# Altium project STM32H743VIT6 Test B'd.PrjPcb
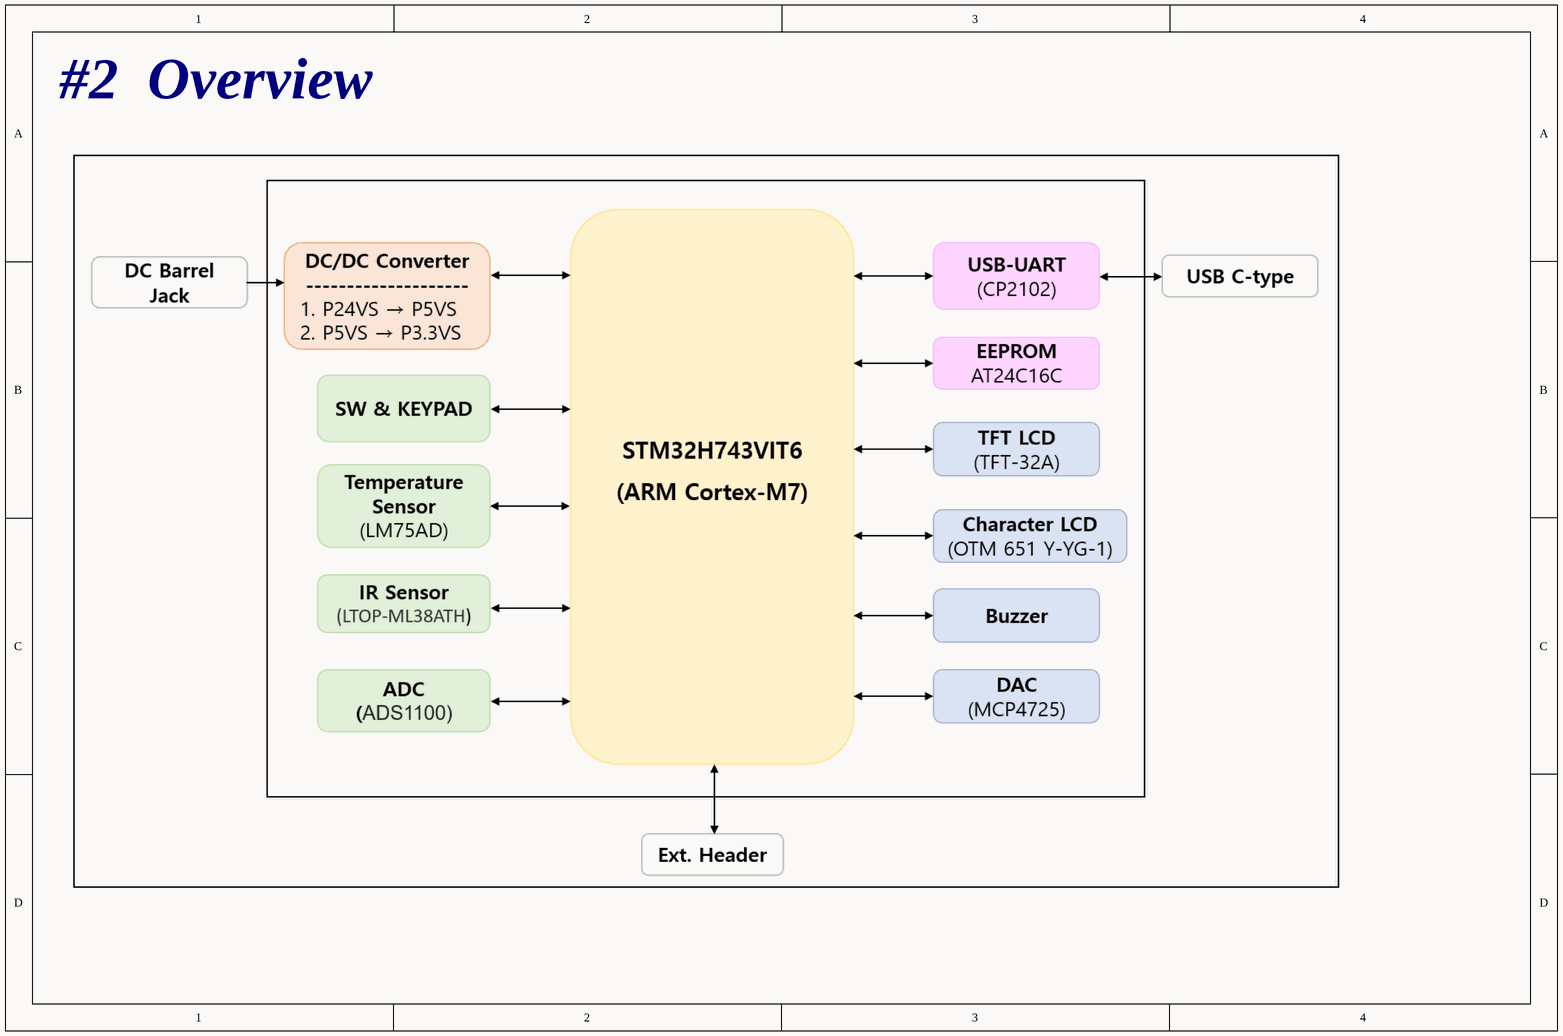
[diagram p0: 01_Overview.SchDoc]
5 sheets, 116 parts. Net scope: flat (ports and power ports of the same name join across sheets).
Board file: STM32H743VIT6_Test_B'd.PcbDoc
Sheets:
  01_Overview.SchDoc
  03_MCU.SchDoc
  04_LCD.SchDoc
  05_Sensor_Keypad.SchDoc
  06_Communication.SchDoc

## Sheet 01_Overview.SchDoc
size A4; Revision: B; SheetNumber: 2; SheetTotal: 7

### Notes on the sheet
- #2  Overview
- Title
- Rev
- Doc
- Sheet #
- of
- Author
- This document is copyright of ArkX and shall not be revealed, produced, copied, in whole or in part,
- Date
- ©2024
- nor used for any purpose other than submitted.

## Sheet 03_MCU.SchDoc
size A3; Author: Ganghyeok Lim; Revision: B; SheetNumber: 4; SheetTotal: 7
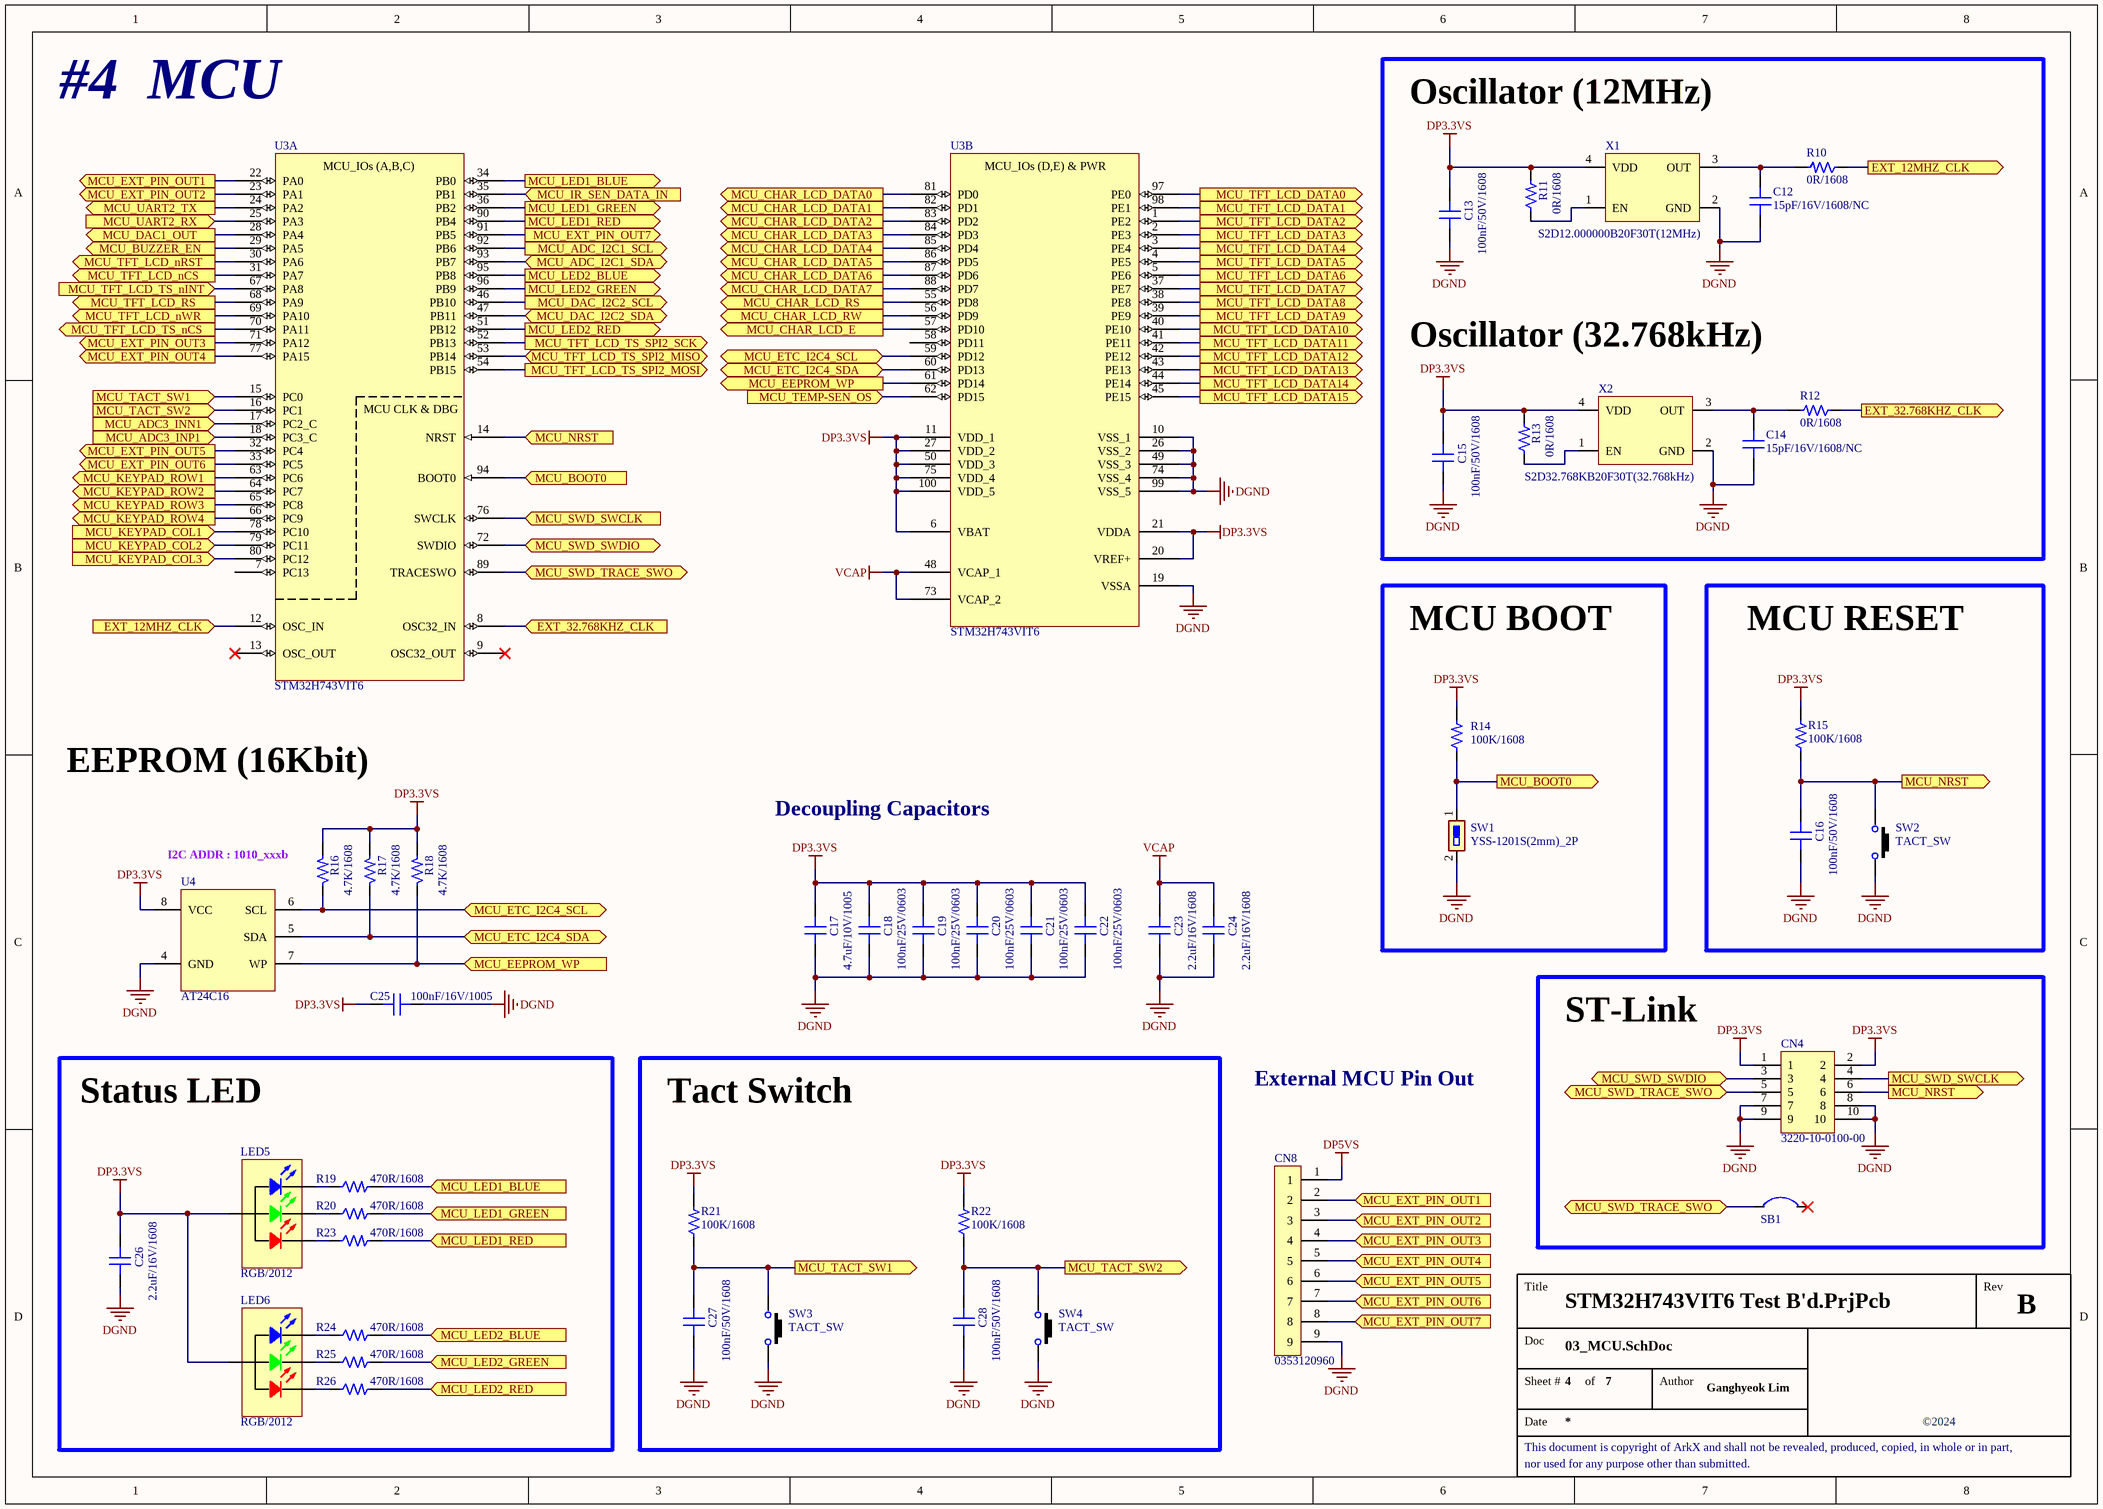
[diagram p1: 03_MCU.SchDoc]

### Parts
C12  15pF/16V/1608/NC  [CAP 1608 (0603_INCH)/NC]
C13  100nF/50V/1608  [CAP 1608 (0603_INCH)]
C14  15pF/16V/1608/NC  [CAP 1608 (0603_INCH)/NC]
C15  100nF/50V/1608  [CAP 1608 (0603_INCH)]
C16  100nF/50V/1608  [CAP 1608 (0603_INCH)]
C17  4.7uF/10V/1005  [CAP 1005 (0402_INCH)]
C18  100nF/25V/0603  [CAP 0603 (0201_INCH)]
C19  100nF/25V/0603  [CAP 0603 (0201_INCH)]
C20  100nF/25V/0603  [CAP 0603 (0201_INCH)]
C21  100nF/25V/0603  [CAP 0603 (0201_INCH)]
C22  100nF/25V/0603  [CAP 0603 (0201_INCH)]
C23  2.2uF/16V/1608  [CAP 1608 (0603_INCH)]
C24  2.2uF/16V/1608  [CAP 1608 (0603_INCH)]
C25  100nF/16V/1005  [CAP 1005 (0402_INCH)]
C26  2.2uF/16V/1608  [CAP 1608 (0603_INCH)]
C27  100nF/50V/1608  [CAP 1608 (0603_INCH)]
C28  100nF/50V/1608  [CAP 1608 (0603_INCH)]
CN4  3220-10-0100-00  [CON 3220-10-0100-00 (Hand_Solder)]
CN8  0353120960  [CON 0353120960 (MOLEX)]
LED5  RGB/2012  [LED MHT170RGBCT]
LED6  RGB/2012  [LED MHT170RGBCT]
R10  0R/1608  [RES 1608 (0603_inch)]
R11  0R/1608  [RES 1608 (0603_inch)]
R12  0R/1608  [RES 1608 (0603_inch)]
R13  0R/1608  [RES 1608 (0603_inch)]
R14  100K/1608  [RES 1608 (0603_inch)]
R15  100K/1608  [RES 1608 (0603_inch)]
R16  4.7K/1608  [RES 1608 (0603_inch)]
R17  4.7K/1608  [RES 1608 (0603_inch)]
R18  4.7K/1608  [RES 1608 (0603_inch)]
R19  470R/1608  [RES 1608 (0603_inch)]
R20  470R/1608  [RES 1608 (0603_inch)]
R21  100K/1608  [RES 1608 (0603_inch)]
R22  100K/1608  [RES 1608 (0603_inch)]
R23  470R/1608  [RES 1608 (0603_inch)]
R24  470R/1608  [RES 1608 (0603_inch)]
R25  470R/1608  [RES 1608 (0603_inch)]
R26  470R/1608  [RES 1608 (0603_inch)]
SB1  SB  [SB (Solder-Bridge)]  (value not drawn)
SW1  YSS-1201S(2mm)_2P  [SW YSS-1201S-2mm]
SW2  TACT_SW  [SW K2-1102SP-C4SC-04]
SW3  TACT_SW  [SW K2-1102SP-C4SC-04]
SW4  TACT_SW  [SW K2-1102SP-C4SC-04]
U3  STM32H743VIT6  [LQFP-100_14x14MM (ST)]  (parts A,B of 2)
U4  AT24C16  [TSSOP-8_PW (TI)]
X1  S2D12.000000B20F30T(12MHz)  [OSC SMD_2.5x2.0 (SCTF)]
X2  S2D32.768KB20F30T(32.768kHz)  [OSC SMD_2.5x2.0 (SCTF)]

### Blocks framed on the sheet
MCU BOOT: R14 SW1
MCU RESET: C16 R15 SW2
ST-Link: CN4 SB1
Status LED: C26 LED5 LED6 R19 R20 R23-R26
Tact Switch: C27 C28 R21 R22 SW3 SW4

### Ports
EXT_12MHZ_CLK (in), EXT_12MHZ_CLK (out), EXT_32.768KHZ_CLK (in), EXT_32.768KHZ_CLK (out), MCU_ADC3_INN1 (in), MCU_ADC3_INP1 (in), MCU_ADC_I2C1_SCL (out), MCU_ADC_I2C1_SDA (bidir), MCU_BOOT0 (in), MCU_BOOT0 (out), MCU_BUZZER_EN (out), MCU_CHAR_LCD_DATA0 (out), MCU_CHAR_LCD_DATA1 (out), MCU_CHAR_LCD_DATA2 (out), MCU_CHAR_LCD_DATA3 (out), MCU_CHAR_LCD_DATA4 (out), MCU_CHAR_LCD_DATA5 (out), MCU_CHAR_LCD_DATA6 (out), MCU_CHAR_LCD_DATA7 (out), MCU_CHAR_LCD_E (out), MCU_CHAR_LCD_RS (out), MCU_CHAR_LCD_RW (out), MCU_DAC1_OUT (out), MCU_DAC_I2C2_SCL (out), MCU_DAC_I2C2_SDA (bidir), MCU_EEPROM_WP (in), MCU_EEPROM_WP (out), MCU_ETC_I2C4_SCL (bidir), MCU_ETC_I2C4_SDA (bidir), MCU_EXT_PIN_OUT1 (in), MCU_EXT_PIN_OUT1 (out), MCU_EXT_PIN_OUT2 (in), MCU_EXT_PIN_OUT2 (out), MCU_EXT_PIN_OUT3 (in), MCU_EXT_PIN_OUT3 (out), MCU_EXT_PIN_OUT4 (in), MCU_EXT_PIN_OUT4 (out), MCU_EXT_PIN_OUT5 (in), MCU_EXT_PIN_OUT5 (out), MCU_EXT_PIN_OUT6 (in), MCU_EXT_PIN_OUT6 (out), MCU_EXT_PIN_OUT7 (in), MCU_EXT_PIN_OUT7 (out), MCU_IR_SEN_DATA_IN (in), MCU_KEYPAD_COL1 (in), MCU_KEYPAD_COL2 (in), MCU_KEYPAD_COL3 (in), MCU_KEYPAD_ROW1 (out), MCU_KEYPAD_ROW2 (out), MCU_KEYPAD_ROW3 (out), MCU_KEYPAD_ROW4 (out), MCU_LED1_BLUE (in), MCU_LED1_BLUE (out), MCU_LED1_GREEN (in), MCU_LED1_GREEN (out), MCU_LED1_RED (in), MCU_LED1_RED (out), MCU_LED2_BLUE (in), MCU_LED2_BLUE (out), MCU_LED2_GREEN (in), MCU_LED2_GREEN (out), MCU_LED2_RED (in), MCU_LED2_RED (out), MCU_NRST (in), MCU_NRST (out), MCU_SWD_SWCLK (in), MCU_SWD_SWCLK (out), MCU_SWD_SWDIO (bidir), MCU_SWD_TRACE_SWO (bidir), MCU_TACT_SW1 (in), MCU_TACT_SW1 (out), MCU_TACT_SW2 (in), MCU_TACT_SW2 (out), MCU_TEMP-SEN_OS (in), MCU_TFT_LCD_DATA0 (out), MCU_TFT_LCD_DATA1 (out), MCU_TFT_LCD_DATA2 (out), MCU_TFT_LCD_DATA3 (out), MCU_TFT_LCD_DATA4 (out), MCU_TFT_LCD_DATA5 (out), MCU_TFT_LCD_DATA6 (out), MCU_TFT_LCD_DATA7 (out), MCU_TFT_LCD_DATA8 (out), MCU_TFT_LCD_DATA9 (out), MCU_TFT_LCD_DATA10 (out), MCU_TFT_LCD_DATA11 (out), MCU_TFT_LCD_DATA12 (out), MCU_TFT_LCD_DATA13 (out), MCU_TFT_LCD_DATA14 (out), MCU_TFT_LCD_DATA15 (out), MCU_TFT_LCD_nCS (out), MCU_TFT_LCD_nRST (out), MCU_TFT_LCD_nWR (out), MCU_TFT_LCD_RS (out), MCU_TFT_LCD_TS_nCS (out), MCU_TFT_LCD_TS_nINT (in), MCU_TFT_LCD_TS_SPI2_MISO (bidir), MCU_TFT_LCD_TS_SPI2_MOSI (out), MCU_TFT_LCD_TS_SPI2_SCK (out), MCU_UART2_RX (in), MCU_UART2_TX (out)

### Nets
DGND: C12.1 C13.1 C14.1 C15.1 C16.1 C17.1 C18.1 C19.1 C20.1 C21.1 C22.1 C23.2 C24.2 C25.1 C26.2 C27.1 C28.1 CN4.7 CN4.8 CN4.9 CN4.10 CN8.9 SW1.2 SW2.1 SW3.1 SW4.1 U3.10(VSS_1) U3.19(VSSA) U3.26(VSS_2) U3.49(VSS_3) U3.74(VSS_4) U3.99(VSS_5) U4.4(GND) X1.2(GND) X2.2(GND)
DP3.3VS: C13.2 C15.2 C17.2 C18.2 C19.2 C20.2 C21.2 C22.2 C25.2 C26.1 CN4.1 CN4.2 LED5.4(Common_Anode) LED6.4(Common_Anode) R11.2 R13.2 R14.2 R15.2 R16.2 R17.2 R18.2 R21.2 R22.2 U3.6(VBAT) U3.11(VDD_1) U3.20(VREF+) U3.21(VDDA) U3.27(VDD_2) U3.50(VDD_3) U3.75(VDD_4) U3.100(VDD_5) U4.8(VCC) X1.4(VDD) X2.4(VDD)
DP5VS: CN8.1
VCAP: C23.1 C24.1 U3.48(VCAP_1) U3.73(VCAP_2)
EXT_12MHZ_CLK: R10.1 U3.12(OSC_IN) ; port EXT_12MHZ_CLK
EXT_32.768KHZ_CLK: R12.1 U3.8(OSC32_IN) ; port EXT_32.768KHZ_CLK
MCU_ADC3_INN1: U3.17(PC2_C) ; port MCU_ADC3_INN1
MCU_ADC3_INP1: U3.18(PC3_C) ; port MCU_ADC3_INP1
MCU_ADC_I2C1_SCL: U3.92(PB6) ; port MCU_ADC_I2C1_SCL
MCU_ADC_I2C1_SDA: U3.93(PB7) ; port MCU_ADC_I2C1_SDA
MCU_BOOT0: R14.1 SW1.1 U3.94(BOOT0) ; port MCU_BOOT0
MCU_BUZZER_EN: U3.29(PA5) ; port MCU_BUZZER_EN
MCU_CHAR_LCD_DATA0: U3.81(PD0) ; port MCU_CHAR_LCD_DATA0
MCU_CHAR_LCD_DATA1: U3.82(PD1) ; port MCU_CHAR_LCD_DATA1
MCU_CHAR_LCD_DATA2: U3.83(PD2) ; port MCU_CHAR_LCD_DATA2
MCU_CHAR_LCD_DATA3: U3.84(PD3) ; port MCU_CHAR_LCD_DATA3
MCU_CHAR_LCD_DATA4: U3.85(PD4) ; port MCU_CHAR_LCD_DATA4
MCU_CHAR_LCD_DATA5: U3.86(PD5) ; port MCU_CHAR_LCD_DATA5
MCU_CHAR_LCD_DATA6: U3.87(PD6) ; port MCU_CHAR_LCD_DATA6
MCU_CHAR_LCD_DATA7: U3.88(PD7) ; port MCU_CHAR_LCD_DATA7
MCU_CHAR_LCD_E: U3.57(PD10) ; port MCU_CHAR_LCD_E
MCU_CHAR_LCD_RS: U3.55(PD8) ; port MCU_CHAR_LCD_RS
MCU_CHAR_LCD_RW: U3.56(PD9) ; port MCU_CHAR_LCD_RW
MCU_DAC1_OUT: U3.28(PA4) ; port MCU_DAC1_OUT
MCU_DAC_I2C2_SCL: U3.46(PB10) ; port MCU_DAC_I2C2_SCL
MCU_DAC_I2C2_SDA: U3.47(PB11) ; port MCU_DAC_I2C2_SDA
MCU_EEPROM_WP: R18.1 U3.61(PD14) U4.7(WP) ; port MCU_EEPROM_WP
MCU_ETC_I2C4_SCL: R16.1 U3.59(PD12) U4.6(SCL) ; port MCU_ETC_I2C4_SCL
MCU_ETC_I2C4_SDA: R17.1 U3.60(PD13) U4.5(SDA) ; port MCU_ETC_I2C4_SDA
MCU_EXT_PIN_OUT1: CN8.2 U3.22(PA0) ; port MCU_EXT_PIN_OUT1
MCU_EXT_PIN_OUT2: CN8.3 U3.23(PA1) ; port MCU_EXT_PIN_OUT2
MCU_EXT_PIN_OUT3: CN8.4 U3.71(PA12) ; port MCU_EXT_PIN_OUT3
MCU_EXT_PIN_OUT4: CN8.5 U3.77(PA15) ; port MCU_EXT_PIN_OUT4
MCU_EXT_PIN_OUT5: CN8.6 U3.32(PC4) ; port MCU_EXT_PIN_OUT5
MCU_EXT_PIN_OUT6: CN8.7 U3.33(PC5) ; port MCU_EXT_PIN_OUT6
MCU_EXT_PIN_OUT7: CN8.8 U3.91(PB5) ; port MCU_EXT_PIN_OUT7
MCU_IR_SEN_DATA_IN: U3.35(PB1) ; port MCU_IR_SEN_DATA_IN
MCU_KEYPAD_COL1: U3.78(PC10) ; port MCU_KEYPAD_COL1
MCU_KEYPAD_COL2: U3.79(PC11) ; port MCU_KEYPAD_COL2
MCU_KEYPAD_COL3: U3.80(PC12) ; port MCU_KEYPAD_COL3
MCU_KEYPAD_ROW1: U3.63(PC6) ; port MCU_KEYPAD_ROW1
MCU_KEYPAD_ROW2: U3.64(PC7) ; port MCU_KEYPAD_ROW2
MCU_KEYPAD_ROW3: U3.65(PC8) ; port MCU_KEYPAD_ROW3
MCU_KEYPAD_ROW4: U3.66(PC9) ; port MCU_KEYPAD_ROW4
MCU_LED1_BLUE: R19.2 U3.34(PB0) ; port MCU_LED1_BLUE
MCU_LED1_GREEN: R20.2 U3.36(PB2) ; port MCU_LED1_GREEN
MCU_LED1_RED: R23.2 U3.90(PB4) ; port MCU_LED1_RED
MCU_LED2_BLUE: R24.2 U3.95(PB8) ; port MCU_LED2_BLUE
MCU_LED2_GREEN: R25.2 U3.96(PB9) ; port MCU_LED2_GREEN
MCU_LED2_RED: R26.2 U3.51(PB12) ; port MCU_LED2_RED
MCU_NRST: C16.2 CN4.6 R15.1 SW2.3 U3.14(NRST) ; port MCU_NRST
MCU_SWD_SWCLK: CN4.4 U3.76(SWCLK) ; port MCU_SWD_SWCLK
MCU_SWD_SWDIO: CN4.3 U3.72(SWDIO) ; port MCU_SWD_SWDIO
MCU_SWD_TRACE_SWO: CN4.5 SB1.1 U3.89(TRACESWO) ; port MCU_SWD_TRACE_SWO
MCU_TACT_SW1: C27.2 R21.1 SW3.3 U3.15(PC0) ; port MCU_TACT_SW1
MCU_TACT_SW2: C28.2 R22.1 SW4.3 U3.16(PC1) ; port MCU_TACT_SW2
MCU_TEMP-SEN_OS: U3.62(PD15) ; port MCU_TEMP-SEN_OS
MCU_TFT_LCD_DATA0: U3.97(PE0) ; port MCU_TFT_LCD_DATA0
MCU_TFT_LCD_DATA1: U3.98(PE1) ; port MCU_TFT_LCD_DATA1
MCU_TFT_LCD_DATA2: U3.1(PE2) ; port MCU_TFT_LCD_DATA2
MCU_TFT_LCD_DATA3: U3.2(PE3) ; port MCU_TFT_LCD_DATA3
MCU_TFT_LCD_DATA4: U3.3(PE4) ; port MCU_TFT_LCD_DATA4
MCU_TFT_LCD_DATA5: U3.4(PE5) ; port MCU_TFT_LCD_DATA5
MCU_TFT_LCD_DATA6: U3.5(PE6) ; port MCU_TFT_LCD_DATA6
MCU_TFT_LCD_DATA7: U3.37(PE7) ; port MCU_TFT_LCD_DATA7
MCU_TFT_LCD_DATA8: U3.38(PE8) ; port MCU_TFT_LCD_DATA8
MCU_TFT_LCD_DATA9: U3.39(PE9) ; port MCU_TFT_LCD_DATA9
MCU_TFT_LCD_DATA10: U3.40(PE10) ; port MCU_TFT_LCD_DATA10
MCU_TFT_LCD_DATA11: U3.41(PE11) ; port MCU_TFT_LCD_DATA11
MCU_TFT_LCD_DATA12: U3.42(PE12) ; port MCU_TFT_LCD_DATA12
MCU_TFT_LCD_DATA13: U3.43(PE13) ; port MCU_TFT_LCD_DATA13
MCU_TFT_LCD_DATA14: U3.44(PE14) ; port MCU_TFT_LCD_DATA14
MCU_TFT_LCD_DATA15: U3.45(PE15) ; port MCU_TFT_LCD_DATA15
MCU_TFT_LCD_nCS: U3.31(PA7) ; port MCU_TFT_LCD_nCS
MCU_TFT_LCD_nRST: U3.30(PA6) ; port MCU_TFT_LCD_nRST
MCU_TFT_LCD_nWR: U3.69(PA10) ; port MCU_TFT_LCD_nWR
MCU_TFT_LCD_RS: U3.68(PA9) ; port MCU_TFT_LCD_RS
MCU_TFT_LCD_TS_nCS: U3.70(PA11) ; port MCU_TFT_LCD_TS_nCS
MCU_TFT_LCD_TS_nINT: U3.67(PA8) ; port MCU_TFT_LCD_TS_nINT
MCU_TFT_LCD_TS_SPI2_MISO: U3.53(PB14) ; port MCU_TFT_LCD_TS_SPI2_MISO
MCU_TFT_LCD_TS_SPI2_MOSI: U3.54(PB15) ; port MCU_TFT_LCD_TS_SPI2_MOSI
MCU_TFT_LCD_TS_SPI2_SCK: U3.52(PB13) ; port MCU_TFT_LCD_TS_SPI2_SCK
MCU_UART2_RX: U3.25(PA3) ; port MCU_UART2_RX
MCU_UART2_TX: U3.24(PA2) ; port MCU_UART2_TX
NetC12_2: C12.2 R10.2 X1.3(OUT)
NetC14_2: C14.2 R12.2 X2.3(OUT)
NetLED5_1: LED5.1(RED) R23.1
NetLED5_2: LED5.2(GREEN) R20.1
NetLED5_3: LED5.3(BLUE) R19.1
NetLED6_1: LED6.1(RED) R26.1
NetLED6_2: LED6.2(GREEN) R25.1
NetLED6_3: LED6.3(BLUE) R24.1
NetR11_1: R11.1 X1.1(EN)
NetR13_1: R13.1 X2.1(EN)

Not connected (* = marked no-connect by the designer): SB1 2*; U3 7(PC13) 9(OSC32_OUT)* 13(OSC_OUT)* 58(PD11)

### Notes on the sheet
- #4  MCU
- Oscillator (12MHz)
- Oscillator (32.768kHz)
- EEPROM (16Kbit)
- I2C ADDR : 1010_xxxb
- Decoupling Capacitors
- External MCU Pin Out
- Title
- Rev
- Doc
- Sheet #
- of
- Author
- This document is copyright of ArkX and shall not be revealed, produced, copied, in whole or in part,
- Date
- ©2024
- nor used for any purpose other than submitted.
- (in symbol IC_MCU_STM32H743VIT6, part A) MCU_IOs (A,B,C); MCU CLK & DBG
- (in symbol IC_MCU_STM32H743VIT6, part B) MCU_IOs (D,E) & PWR

### Library data of the parts
C12 C14 = CAP_NC_15pF/16V/1608: Ceramic CAP_15pF/16V/1608
C13 C15 C16 C27 C28 = CAP_100nF/50V/1608: Ceramic CAP_100nF/50V/1608; LCSC Part #: C14663; JLCPCB Part Type: Basic Part
C17 = CAP_4.7uF/10V/1005: Ceramic CAP_4.7uF/10V/1005; LCSC Part #: C23733; JLCPCB Part Type: Basic Part
C18-C22 = CAP_100nF/25V/0603: Ceramic CAP_100nF/25V/0603; JLCPCB Part Type: Extended Part; LCSC Part #: C181047
C23 C24 C26 = CAP_2.2uF/16V/1608: Ceramic CAP_2.2uF/16V/1608; LCSC Part #: C23630; JLCPCB Part Type: Basic Part
C25 = CAP_100nF/16V/1005: Ceramic CAP_100nF/16V/1005; LCSC Part #: C1525; JLCPCB Part Type: Basic Part
CN4 = CON_IDC_3220-10-0100-00: CONN HEADER VERT 10POS 1.27MM
CN8 = CON_0353120960: CONN HEADER VERT 9POS 2.5MM
LED5 LED6 = LED_RGB_MHT170RGBCT: Colorless transparence -30℃~+85℃ Positive post Common anode RGB 120° 0805  Light Emitting Diodes (LED) ROHS; LCSC Part #: C2962094; JLCPCB Part Ype: Extended Part
R10-R13 = RES_0R/1608/0.1W: Value: 0R; Power Rating: 0.1W; Precision: 1%; Size: 1608; LCSC Part #: C21189; JLCPCB Part Type: Basic Part
R14 R15 R21 R22 = RES_100K/1608/0.1W: Value: 100K; Power Rating: 0.1W; Precision: 1%; Size: 1608; LCSC Part #: C25803; JLCPCB Part Type: Basic Part
R16-R18 = RES_4.7K/1608/0.1W: Value: 4.7K; Power Rating: 0.1W; Precision: 1%; Size: 1608; LCSC Part #: C23162; JLCPCB Part Type: Basic Part
R19 R20 R23-R26 = RES_470R/1608/0.1W: Value: 470R; Power Rating: 0.1W; Precision: 1%; Size: 1608; LCSC Part #: C23179; JLCPCB Part Type: Basic Part
SB1 = SB_Solder-Bridge
SW1 = SW_YSS-1201S(2mm)_2P: SMD Slide Switch. / Rating : DC 6V/0.3A / Travel : 2MM
SW2-SW4 = SW_K2-1102SP-C4SC-04(2P): -25℃~+85℃ 6mm 5mm Round Button 50mA Brick nogging 6mm SPST 100MΩ 100000 250gf@±30gf 12V SMD  Tactile Switches ROHS; LCSC Part #: C127509; JLCPCB Part Type: Extended Part
U3 = IC_MCU_STM32H743VIT6: MCU High-performance & DSP DP-FPU, Arm Cortex-M7 MCU 2MBytes of Flash 1MB RAM, 480 M; LCSC Part #: C114409; JLCPCB Part Type: Extended Part
U4 = IC_EEPROM_AT24C16: IC EEPROM 16KBIT I2C 1MHZ 8TSSOP; LCSC Part #: C112954; JLCPCB Part Type: Extended Part
X1 = OSC_S2D12.000000B20F30T(12MHz): 3.3V~3.3V -40℃~+85℃ 20mA ±20ppm 12MHz SMD2520-4P  Oscillators ROHS; LCSC Part #: C387449; JLCPCB Part Type: Extended Part
X2 = OSC_S2D32.768KB20F30T(32.768kHz): 3.3V ±20ppm CMOS 32.768kHz SMD2520-4P  Oscillators ROHS; LCSC Part #: C387463; JLCPCB Part Type: Extended Part

## Sheet 04_LCD.SchDoc
size A4; Author: Ganghyeok Lim; Revision: B; SheetNumber: 5; SheetTotal: 7
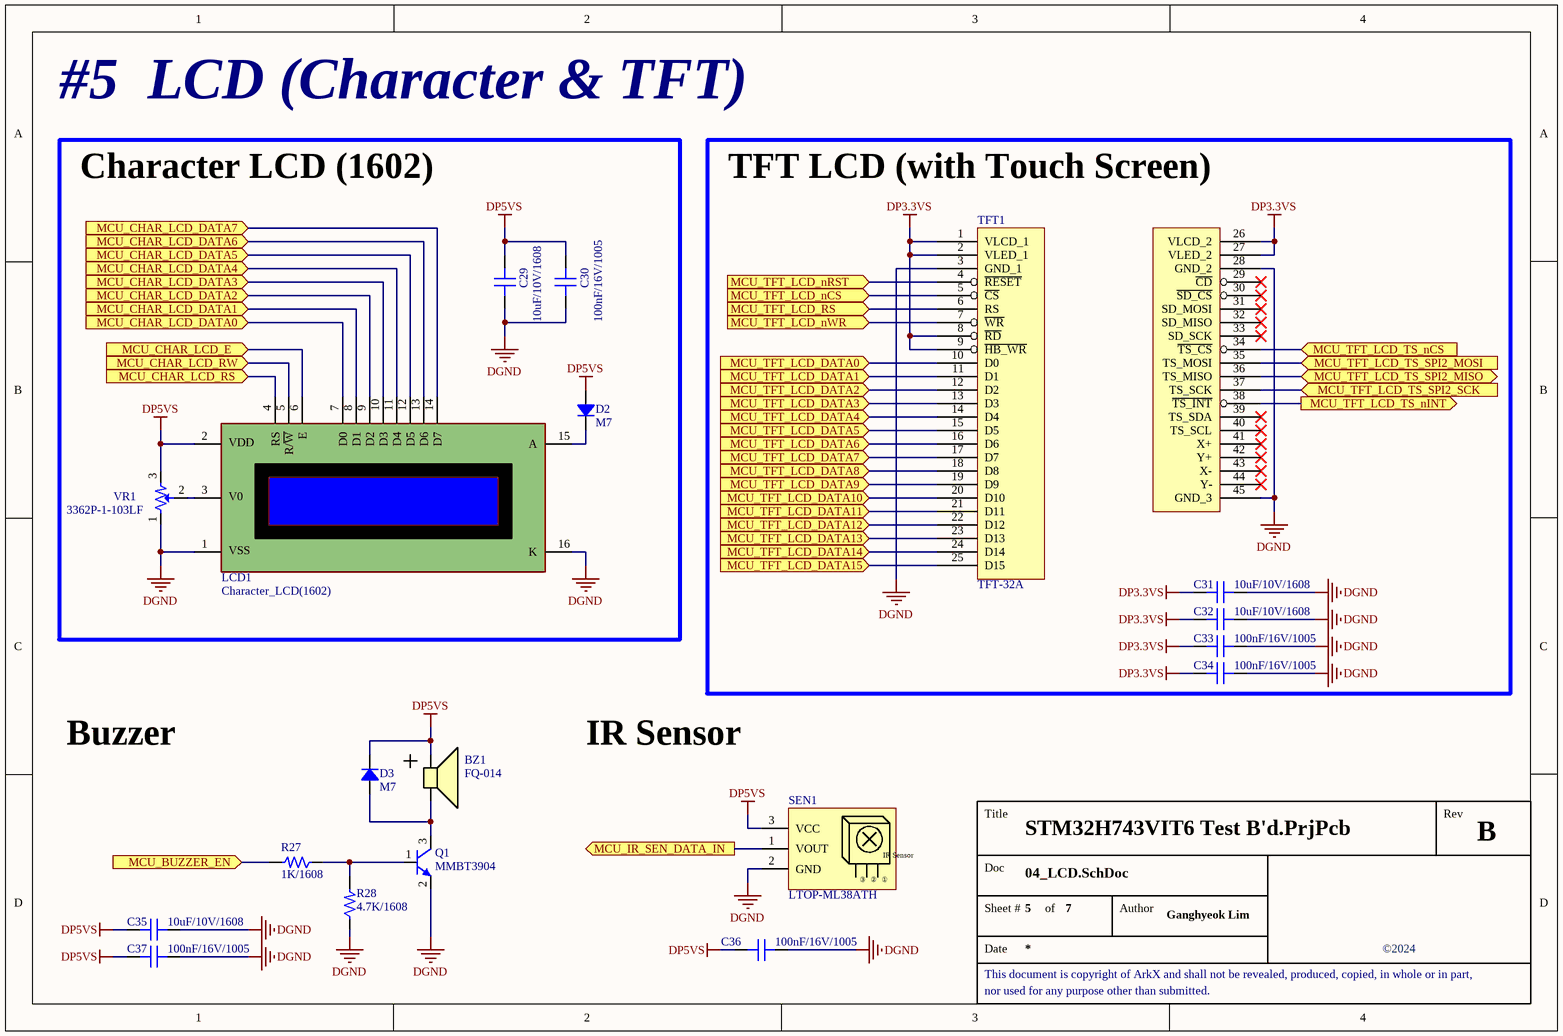
[diagram p2: 04_LCD.SchDoc]

### Parts
BZ1  FQ-014  [BUZ FQ-013]
C29  10uF/10V/1608  [CAP 1608 (0603_INCH)]
C30  100nF/16V/1005  [CAP 1005 (0402_INCH)]
C31  10uF/10V/1608  [CAP 1608 (0603_INCH)]
C32  10uF/10V/1608  [CAP 1608 (0603_INCH)]
C33  100nF/16V/1005  [CAP 1005 (0402_INCH)]
C34  100nF/16V/1005  [CAP 1005 (0402_INCH)]
C35  10uF/10V/1608  [CAP 1608 (0603_INCH)]
C36  100nF/16V/1005  [CAP 1005 (0402_INCH)]
C37  100nF/16V/1005  [CAP 1005 (0402_INCH)]
D2  M7  [DIO DO-214AC (SMA)]
D3  M7  [DIO DO-214AC (SMA)]
LCD1  Character_LCD(1602)  [LCD_CHARACTOR-1602]
Q1  MMBT3904  [SOT 23-3 (DIODES INCORPORATED)]
R27  1K/1608  [RES 1608 (0603_inch)]
R28  4.7K/1608  [RES 1608 (0603_inch)]
SEN1  LTOP-ML38ATH  [SEN_IR-LTOP-ML38ATH]
TFT1  TFT-32A  [LCD_TFT-32A]
VR1  3362P-1-103LF  [VR_3362P-1-103LF]

### Blocks framed on the sheet
Character LCD (1602): C29 C30 D2 LCD1 VR1
TFT LCD (with Touch Screen): C31-C34 TFT1

### Ports
MCU_BUZZER_EN (in), MCU_CHAR_LCD_DATA0 (in), MCU_CHAR_LCD_DATA1 (in), MCU_CHAR_LCD_DATA2 (in), MCU_CHAR_LCD_DATA3 (in), MCU_CHAR_LCD_DATA4 (in), MCU_CHAR_LCD_DATA5 (in), MCU_CHAR_LCD_DATA6 (in), MCU_CHAR_LCD_DATA7 (in), MCU_CHAR_LCD_E (in), MCU_CHAR_LCD_RS (in), MCU_CHAR_LCD_RW (in), MCU_IR_SEN_DATA_IN (out), MCU_TFT_LCD_DATA0 (in), MCU_TFT_LCD_DATA1 (in), MCU_TFT_LCD_DATA2 (in), MCU_TFT_LCD_DATA3 (in), MCU_TFT_LCD_DATA4 (in), MCU_TFT_LCD_DATA5 (in), MCU_TFT_LCD_DATA6 (in), MCU_TFT_LCD_DATA7 (in), MCU_TFT_LCD_DATA8 (in), MCU_TFT_LCD_DATA9 (in), MCU_TFT_LCD_DATA10 (in), MCU_TFT_LCD_DATA11 (in), MCU_TFT_LCD_DATA12 (in), MCU_TFT_LCD_DATA13 (in), MCU_TFT_LCD_DATA14 (in), MCU_TFT_LCD_DATA15 (in), MCU_TFT_LCD_nCS (in), MCU_TFT_LCD_nRST (in), MCU_TFT_LCD_nWR (in), MCU_TFT_LCD_RS (in), MCU_TFT_LCD_TS_nCS (in), MCU_TFT_LCD_TS_nINT (out), MCU_TFT_LCD_TS_SPI2_MISO (bidir), MCU_TFT_LCD_TS_SPI2_MOSI (in), MCU_TFT_LCD_TS_SPI2_SCK (in)

### Nets
DGND: C29.1 C30.1 C31.1 C32.1 C33.1 C34.1 C35.1 C36.1 C37.1 LCD1.1(VSS) LCD1.16(K) Q1.2(E) R28.1 SEN1.2(GND) TFT1.3(GND_1) TFT1.28(GND_2) TFT1.45(GND_3) VR1.1
DP3.3VS: C31.2 C32.2 C33.2 C34.2 TFT1.1(VLCD_1) TFT1.2(VLED_1) TFT1.8(~{RD}) TFT1.9(~{HB_WR}) TFT1.26(VLCD_2) TFT1.27(VLED_2)
DP5VS: BZ1.1 C29.2 C30.2 C35.2 C36.2 C37.2 D2.1 D3.2 LCD1.2(VDD) SEN1.3(VCC) VR1.3
MCU_BUZZER_EN: R27.2 ; port MCU_BUZZER_EN
MCU_CHAR_LCD_DATA0: LCD1.7(D0) ; port MCU_CHAR_LCD_DATA0
MCU_CHAR_LCD_DATA1: LCD1.8(D1) ; port MCU_CHAR_LCD_DATA1
MCU_CHAR_LCD_DATA2: LCD1.9(D2) ; port MCU_CHAR_LCD_DATA2
MCU_CHAR_LCD_DATA3: LCD1.10(D3) ; port MCU_CHAR_LCD_DATA3
MCU_CHAR_LCD_DATA4: LCD1.11(D4) ; port MCU_CHAR_LCD_DATA4
MCU_CHAR_LCD_DATA5: LCD1.12(D5) ; port MCU_CHAR_LCD_DATA5
MCU_CHAR_LCD_DATA6: LCD1.13(D6) ; port MCU_CHAR_LCD_DATA6
MCU_CHAR_LCD_DATA7: LCD1.14(D7) ; port MCU_CHAR_LCD_DATA7
MCU_CHAR_LCD_E: LCD1.6(E) ; port MCU_CHAR_LCD_E
MCU_CHAR_LCD_RS: LCD1.4(RS) ; port MCU_CHAR_LCD_RS
MCU_CHAR_LCD_RW: LCD1.5(R/~{W}) ; port MCU_CHAR_LCD_RW
MCU_IR_SEN_DATA_IN: SEN1.1(VOUT) ; port MCU_IR_SEN_DATA_IN
MCU_TFT_LCD_DATA0: TFT1.10(D0) ; port MCU_TFT_LCD_DATA0
MCU_TFT_LCD_DATA1: TFT1.11(D1) ; port MCU_TFT_LCD_DATA1
MCU_TFT_LCD_DATA2: TFT1.12(D2) ; port MCU_TFT_LCD_DATA2
MCU_TFT_LCD_DATA3: TFT1.13(D3) ; port MCU_TFT_LCD_DATA3
MCU_TFT_LCD_DATA4: TFT1.14(D4) ; port MCU_TFT_LCD_DATA4
MCU_TFT_LCD_DATA5: TFT1.15(D5) ; port MCU_TFT_LCD_DATA5
MCU_TFT_LCD_DATA6: TFT1.16(D6) ; port MCU_TFT_LCD_DATA6
MCU_TFT_LCD_DATA7: TFT1.17(D7) ; port MCU_TFT_LCD_DATA7
MCU_TFT_LCD_DATA8: TFT1.18(D8) ; port MCU_TFT_LCD_DATA8
MCU_TFT_LCD_DATA9: TFT1.19(D9) ; port MCU_TFT_LCD_DATA9
MCU_TFT_LCD_DATA10: TFT1.20(D10) ; port MCU_TFT_LCD_DATA10
MCU_TFT_LCD_DATA11: TFT1.21(D11) ; port MCU_TFT_LCD_DATA11
MCU_TFT_LCD_DATA12: TFT1.22(D12) ; port MCU_TFT_LCD_DATA12
MCU_TFT_LCD_DATA13: TFT1.23(D13) ; port MCU_TFT_LCD_DATA13
MCU_TFT_LCD_DATA14: TFT1.24(D14) ; port MCU_TFT_LCD_DATA14
MCU_TFT_LCD_DATA15: TFT1.25(D15) ; port MCU_TFT_LCD_DATA15
MCU_TFT_LCD_nCS: TFT1.5(~{CS}) ; port MCU_TFT_LCD_nCS
MCU_TFT_LCD_nRST: TFT1.4(~{RESET}) ; port MCU_TFT_LCD_nRST
MCU_TFT_LCD_nWR: TFT1.7(~{WR}) ; port MCU_TFT_LCD_nWR
MCU_TFT_LCD_RS: TFT1.6(RS) ; port MCU_TFT_LCD_RS
MCU_TFT_LCD_TS_nCS: TFT1.34(~{TS_CS}) ; port MCU_TFT_LCD_TS_nCS
MCU_TFT_LCD_TS_nINT: TFT1.38(~{TS_INT}) ; port MCU_TFT_LCD_TS_nINT
MCU_TFT_LCD_TS_SPI2_MISO: TFT1.36(TS_MISO) ; port MCU_TFT_LCD_TS_SPI2_MISO
MCU_TFT_LCD_TS_SPI2_MOSI: TFT1.35(TS_MOSI) ; port MCU_TFT_LCD_TS_SPI2_MOSI
MCU_TFT_LCD_TS_SPI2_SCK: TFT1.37(TS_SCK) ; port MCU_TFT_LCD_TS_SPI2_SCK
NetBZ1_2: BZ1.2 D3.1 Q1.3(C)
NetD2_2: D2.2 LCD1.15(A)
NetLCD1_3: LCD1.3(V0) VR1.2
NetQ1_1: Q1.1(B) R27.1 R28.2

Not connected (* = marked no-connect by the designer): TFT1 29(~{CD})* 30(~{SD_CS})* 31(SD_MOSI)* 32(SD_MISO)* 33(SD_SCK)* 39(TS_SDA)* 40(TS_SCL)* 41(X+)* 42(Y+)* 43(X-)* 44(Y-)*

### Notes on the sheet
- #5  LCD (Character & TFT)
- Buzzer
- IR Sensor
- Title
- Rev
- Doc
- Sheet #
- of
- Author
- This document is copyright of ArkX and shall not be revealed, produced, copied, in whole or in part,
- Date
- ©2024
- nor used for any purpose other than submitted.
- (in symbol SEN_IR_LTOP-ML38ATH) IR Sensor; ③; ②; ①

### Library data of the parts
BZ1 = BZ_FQ-014: Magnetic Active Buzzer / Rated Voltage: 5V / Size: 9x5.5mm
C29 C31 C32 C35 = CAP_10uF/10V/1608: Ceramic CAP_10uF/10V/1608; LCSC Part #: C19702; JLCPCB Part Type: Basic Part
C30 C33 C34 C36 C37 = CAP_100nF/16V/1005: Ceramic CAP_100nF/16V/1005; LCSC Part #: C1525; JLCPCB Part Type: Basic Part
D2 D3 = DIO_M7: 1A 5uA@1kV 1kV 1.1V@1A SMA(DO-214AC)  Diodes - General Purpose ROHS; LCSC Part #: C95872; JLCPCB Part Type: Basic Part
LCD1 = LCD_Character-1602
Q1 = BJT_NPN_MMBT3904: 100nA 40V 200mW 200mA 100@10mA,1V 300MHz 300mV@50mA,5mA NPN +150℃@(Tj) SOT-23(SOT-23-3)  Bipolar Transistors - BJT ROHS; LCSC Part #: C20526; JLCPCB Part Type: Basic Part
R27 = RES_1K/1608/0.1W: Value: 1K; Power Rating: 0.1W; Precision: 1%; Size: 1608; LCSC Part #: C21190; JLCPCB Part Type: Basic Part
R28 = RES_4.7K/1608/0.1W: as R16 on sheet 03_MCU; Size: 1608; LCSC Part #: C23162; JLCPCB Part Type: Basic Part
SEN1 = SEN_IR_LTOP-ML38ATH
TFT1 = LCD_TFT-32A
VR1 = VR_3362P-1-103LF: ±10% ±100ppm/℃ 10kΩ Plugin  Variable Resistors/Potentiometers ROHS; LCSC Part #: C58159; JLCPCB Part Type: Extended Part

## Sheet 05_Sensor_Keypad.SchDoc
size A4; Author: Ganghyeok Lim; Revision: B; SheetNumber: 6; SheetTotal: 7
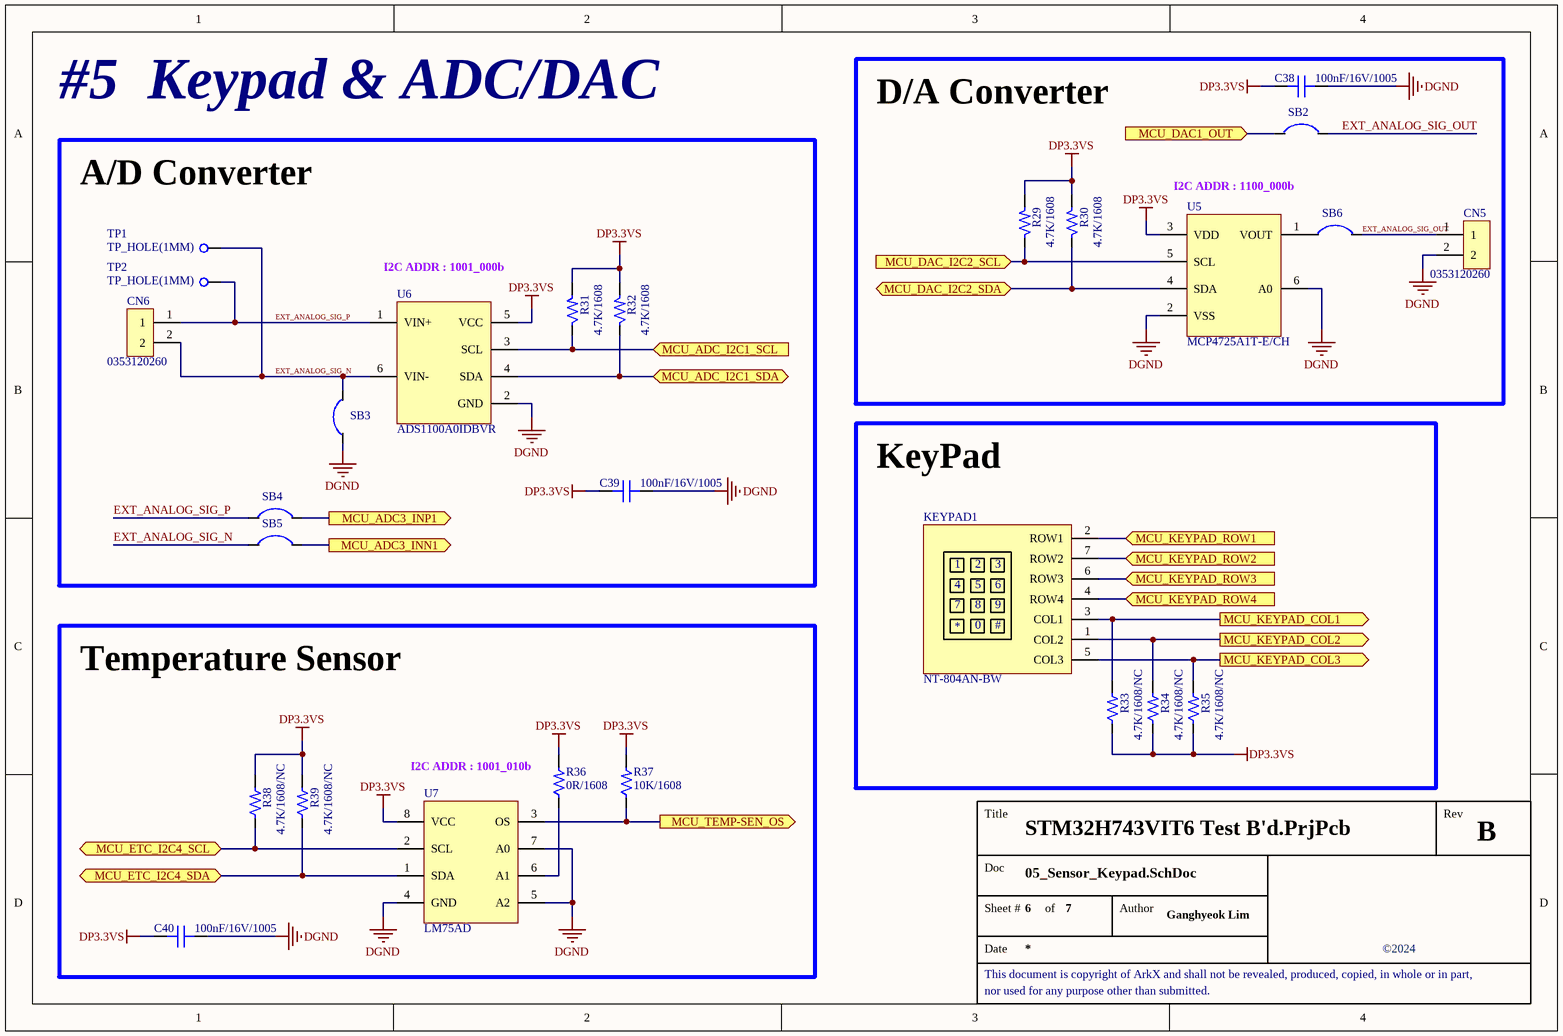
[diagram p3: 05_Sensor_Keypad.SchDoc]

### Parts
C38  100nF/16V/1005  [CAP 1005 (0402_INCH)]
C39  100nF/16V/1005  [CAP 1005 (0402_INCH)]
C40  100nF/16V/1005  [CAP 1005 (0402_INCH)]
CN5  0353120260  [CON 0353120260 (MOLEX)]
CN6  0353120260  [CON 0353120260 (MOLEX)]
KEYPAD1  NT-804AN-BW  [KEYPAD_NT-804AN-BW]
R29  4.7K/1608  [RES 1608 (0603_inch)]
R30  4.7K/1608  [RES 1608 (0603_inch)]
R31  4.7K/1608  [RES 1608 (0603_inch)]
R32  4.7K/1608  [RES 1608 (0603_inch)]
R33  4.7K/1608/NC  [RES 1608 (0603_inch)/NC]
R34  4.7K/1608/NC  [RES 1608 (0603_inch)/NC]
R35  4.7K/1608/NC  [RES 1608 (0603_inch)/NC]
R36  0R/1608  [RES 1608 (0603_inch)]
R37  10K/1608  [RES 1608 (0603_inch)]
R38  4.7K/1608/NC  [RES 1608 (0603_inch)/NC]
R39  4.7K/1608/NC  [RES 1608 (0603_inch)/NC]
SB2  SB  [SB (Solder-Bridge)]  (value not drawn)
SB3  SB  [SB (Solder-Bridge)]  (value not drawn)
SB4  SB  [SB (Solder-Bridge)]  (value not drawn)
SB5  SB  [SB (Solder-Bridge)]  (value not drawn)
SB6  SB  [SB (Solder-Bridge)]  (value not drawn)
TP1  TP_HOLE(1MM)  [TP_HOLE(1MM)]
TP2  TP_HOLE(1MM)  [TP_HOLE(1MM)]
U5  MCP4725A1T-E/CH  [SOT-23-6 (TI DBV PACKAGE)]
U6  ADS1100A0IDBVR  [SOT-23-6 (TI DBV PACKAGE)]
U7  LM75AD  [SOIC-8 150mil Wide (MICRO CHIP)]

### Blocks framed on the sheet
D/A Converter: C38 CN5 R29 R30 SB2 SB6 U5
A/D Converter: C39 CN6 R31 R32 SB3-SB5 TP1 TP2 U6
KeyPad: KEYPAD1 R33-R35
Temperature Sensor: C40 R36-R39 U7

### Ports
MCU_ADC3_INN1 (out), MCU_ADC3_INP1 (out), MCU_ADC_I2C1_SCL (in), MCU_ADC_I2C1_SDA (bidir), MCU_DAC1_OUT (in), MCU_DAC_I2C2_SCL (in), MCU_DAC_I2C2_SDA (bidir), MCU_ETC_I2C4_SCL (bidir), MCU_ETC_I2C4_SDA (bidir), MCU_KEYPAD_COL1 (out), MCU_KEYPAD_COL2 (out), MCU_KEYPAD_COL3 (out), MCU_KEYPAD_ROW1 (in), MCU_KEYPAD_ROW2 (in), MCU_KEYPAD_ROW3 (in), MCU_KEYPAD_ROW4 (in), MCU_TEMP-SEN_OS (out)

### Nets
DGND: C38.1 C39.1 C40.1 CN5.2 SB3.1 U5.2(VSS) U5.6(A0) U6.2(GND) U7.4(GND) U7.5(A2) U7.7(A0)
DP3.3VS: C38.2 C39.2 C40.2 R29.2 R30.2 R31.2 R32.2 R33.1 R34.1 R35.1 R36.2 R37.2 R38.2 R39.2 U5.3(VDD) U6.5(VCC) U7.8(VCC)
EXT_ANALOG_SIG_N: CN6.2 SB3.2 SB5.1 TP1.1(TP) U6.6(VIN-)
EXT_ANALOG_SIG_OUT: CN5.1 SB2.2 SB6.2
EXT_ANALOG_SIG_P: CN6.1 SB4.1 TP2.1(TP) U6.1(VIN+)
MCU_ADC3_INN1: SB5.2 ; port MCU_ADC3_INN1
MCU_ADC3_INP1: SB4.2 ; port MCU_ADC3_INP1
MCU_ADC_I2C1_SCL: R31.1 U6.3(SCL) ; port MCU_ADC_I2C1_SCL
MCU_ADC_I2C1_SDA: R32.1 U6.4(SDA) ; port MCU_ADC_I2C1_SDA
MCU_DAC1_OUT: SB2.1 ; port MCU_DAC1_OUT
MCU_DAC_I2C2_SCL: R29.1 U5.5(SCL) ; port MCU_DAC_I2C2_SCL
MCU_DAC_I2C2_SDA: R30.1 U5.4(SDA) ; port MCU_DAC_I2C2_SDA
MCU_ETC_I2C4_SCL: R38.1 U7.2(SCL) ; port MCU_ETC_I2C4_SCL
MCU_ETC_I2C4_SDA: R39.1 U7.1(SDA) ; port MCU_ETC_I2C4_SDA
MCU_KEYPAD_COL1: KEYPAD1.3(COL1) R33.2 ; port MCU_KEYPAD_COL1
MCU_KEYPAD_COL2: KEYPAD1.1(COL2) R34.2 ; port MCU_KEYPAD_COL2
MCU_KEYPAD_COL3: KEYPAD1.5(COL3) R35.2 ; port MCU_KEYPAD_COL3
MCU_KEYPAD_ROW1: KEYPAD1.2(ROW1) ; port MCU_KEYPAD_ROW1
MCU_KEYPAD_ROW2: KEYPAD1.7(ROW2) ; port MCU_KEYPAD_ROW2
MCU_KEYPAD_ROW3: KEYPAD1.6(ROW3) ; port MCU_KEYPAD_ROW3
MCU_KEYPAD_ROW4: KEYPAD1.4(ROW4) ; port MCU_KEYPAD_ROW4
MCU_TEMP-SEN_OS: R37.1 U7.3(OS) ; port MCU_TEMP-SEN_OS
NetR36_1: R36.1 U7.6(A1)
NetSB6_1: SB6.1 U5.1(VOUT)

### Notes on the sheet
- #5  Keypad & ADC/DAC
- I2C ADDR : 1100_000b
- I2C ADDR : 1001_000b
- (near R36) I2C ADDR : 1001_010b
- Title
- Rev
- Doc
- Sheet #
- of
- Author
- This document is copyright of ArkX and shall not be revealed, produced, copied, in whole or in part,
- Date
- ©2024
- nor used for any purpose other than submitted.
- (in symbol KEYPAD_NT-804AN-BW) 8; 9; 0; #

### Library data of the parts
C38-C40 = CAP_100nF/16V/1005: Ceramic CAP_100nF/16V/1005; LCSC Part #: C1525; JLCPCB Part Type: Basic Part
CN5 CN6 = CON_0353120260: CONN HEADER VERT 2POS 2.5MM
KEYPAD1 = KEYPAD_NT-804AN-BW: Legend(Character) type : Alpha-Numeric, Body/Key color : WHITE, Character color : BLACK
R29-R32 = RES_4.7K/1608/0.1W: as R16 on sheet 03_MCU; Size: 1608; LCSC Part #: C23162; JLCPCB Part Type: Basic Part
R33-R35 R38 R39 = RES_NC_4.7K/1608/0.1W: RES_4.7K/1608/0.1W; Value: 4.7K; Power Rating: 0.1W; Precision: 1%; Size: 1608
R36 = RES_0R/1608/0.1W: as R10 on sheet 03_MCU; Size: 1608; LCSC Part #: C21189; JLCPCB Part Type: Basic Part
R37 = RES_10K/1608/0.1W: Value: 10K; Power Rating: 0.1W; Precision: 1%; Size: 1608; LCSC Part #: C25804; JLCPCB Part Type: Basic Part
SB2-SB6 = SB_Solder-Bridge
U5 = IC_DAC_MCP4725A1T-E/CH: IC DAC 12BIT V-OUT SOT23-6; LCSC Part #: C61423; JLCPCB Part Type: Extended Part
U6 = IC_ADC_ADS1100A0IDBVR: IC ADC 16BIT SIGMA-DELTA SOT23-6; LCSC Part #: C23361; JLCPCB Part Type: Extended Part
U7 = IC_TEMP-SEN_LM75AD: Board Mount Temperature Sensors TEMP SENSOR DIGITAL; LCSC Part #: C7963; JLCPCB Part Type: Extended Part

## Sheet 06_Communication.SchDoc
size A4; Author: Ganghyeok Lim; Revision: B; SheetNumber: 7; SheetTotal: 7
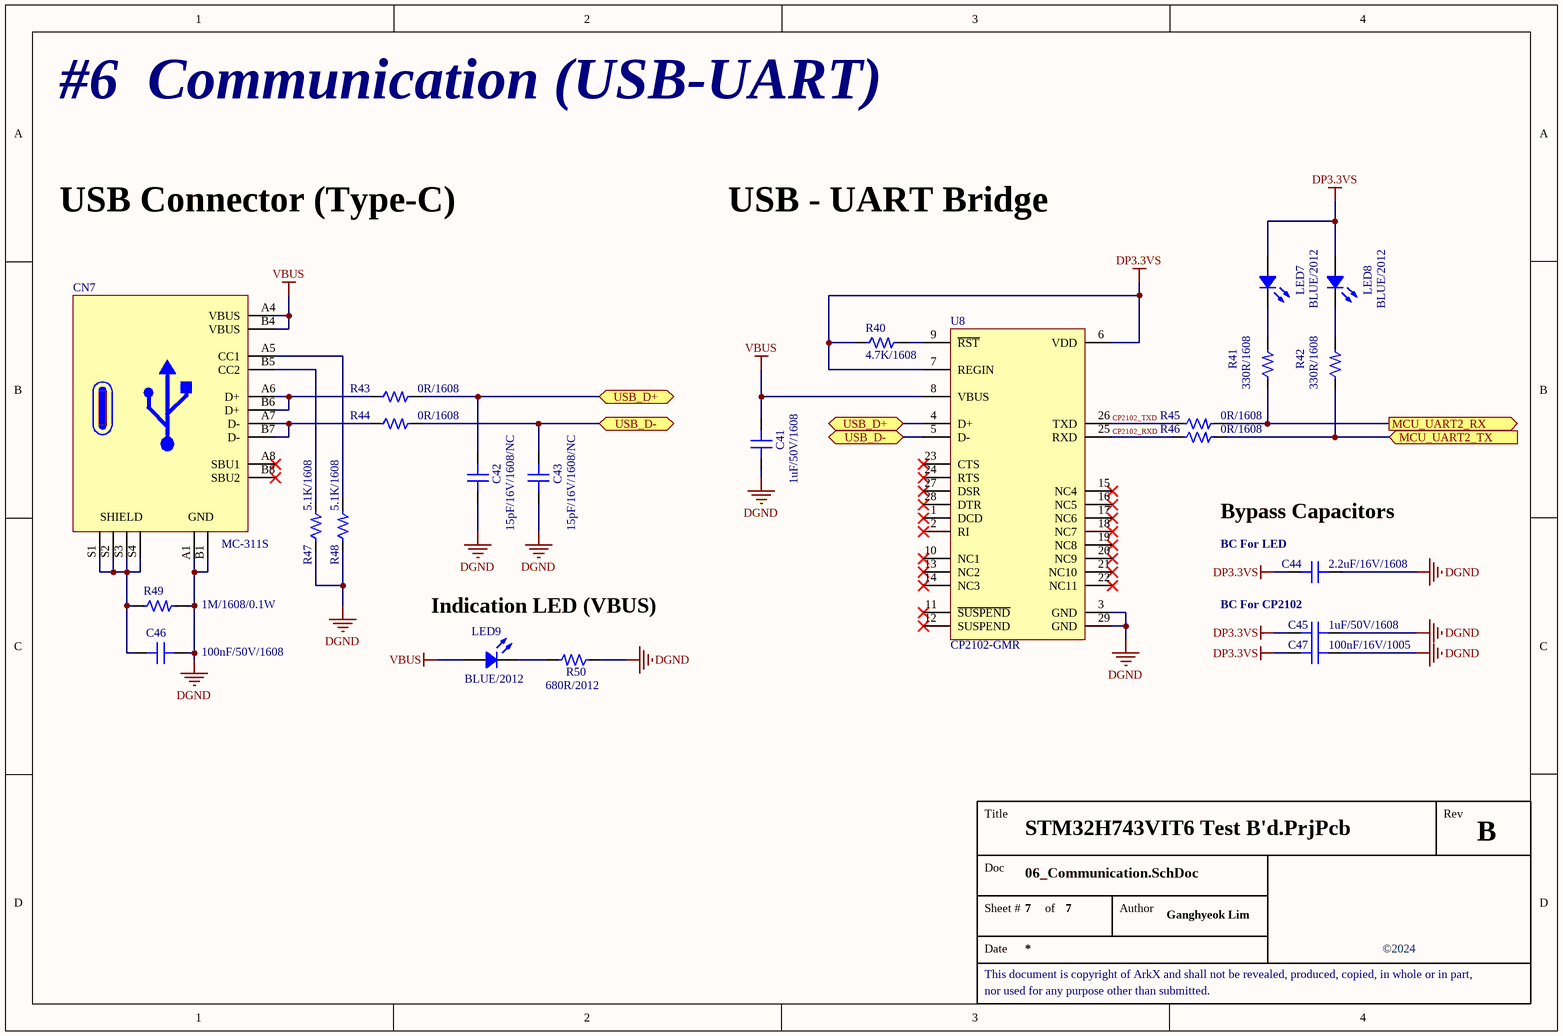
[diagram p4: 06_Communication.SchDoc]

### Parts
C41  1uF/50V/1608  [CAP 1608 (0603_INCH)]
C42  15pF/16V/1608/NC  [CAP 1608 (0603_INCH)/NC]
C43  15pF/16V/1608/NC  [CAP 1608 (0603_INCH)/NC]
C44  2.2uF/16V/1608  [CAP 1608 (0603_INCH)]
C45  1uF/50V/1608  [CAP 1608 (0603_INCH)]
C46  100nF/50V/1608  [CAP 1608 (0603_INCH)]
C47  100nF/16V/1005  [CAP 1005 (0402_INCH)]
CN7  MC-311S  [CON USB-Type-C (16P)]
LED7  BLUE/2012  [LED MHT170RGBCT (BLUE)]
LED8  BLUE/2012  [LED MHT170RGBCT (BLUE)]
LED9  BLUE/2012  [LED MHT170RGBCT (BLUE)]
R40  4.7K/1608  [RES 1608 (0603_inch)]
R41  330R/1608  [RES 1608 (0603_inch)]
R42  330R/1608  [RES 1608 (0603_inch)]
R43  0R/1608  [RES 1608 (0603_inch)]
R44  0R/1608  [RES 1608 (0603_inch)]
R45  0R/1608  [RES 1608 (0603_inch)]
R46  0R/1608  [RES 1608 (0603_inch)]
R47  5.1K/1608  [RES 1608 (0603_inch)]
R48  5.1K/1608  [RES 1608 (0603_inch)]
R49  1M/1608/0.1W  [RES 1608 (0603_inch)]
R50  680R/2012  [RES 2012 (0805_inch)]
U8  CP2102-GMR  [QFN-28 (5x5mm)]

### Ports
MCU_UART2_RX (out), MCU_UART2_TX (in), USB_D+ (bidir), USB_D- (bidir)

### Nets
DGND: C41.1 C42.1 C43.1 C44.2 C45.1 C46.2 C47.1 CN7.A1(GND) CN7.B1(GND) R47.1 R48.1 R49.2 R50.1 U8.3(GND) U8.29(GND)
DP3.3VS: C44.1 C45.2 C47.2 LED7.4(Common_Anode) LED8.4(Common_Anode) R40.1 U8.6(VDD) U8.7(REGIN)
VBUS: C41.2 CN7.A4(VBUS) CN7.B4(VBUS) LED9.4(Common_Anode) U8.8(VBUS)
CP2102_RXD: R46.1 U8.25(RXD)
CP2102_TXD: R45.1 U8.26(TXD)
MCU_UART2_RX: R41.1 R45.2 ; port MCU_UART2_RX
MCU_UART2_TX: R42.1 R46.2 ; port MCU_UART2_TX
USB_D+: C42.2 R43.2 U8.4(D+) ; port USB_D+
USB_D-: C43.2 R44.2 U8.5(D-) ; port USB_D-
NetC46_1: C46.1 CN7.S1(SHIELD) CN7.S2(SHIELD) CN7.S3(SHIELD) CN7.S4(SHIELD) R49.1
NetCN7_A5: CN7.A5(CC1) R48.2
NetCN7_A6: CN7.A6(D+) CN7.B6(D+) R43.1
NetCN7_A7: CN7.A7(D-) CN7.B7(D-) R44.1
NetCN7_B5: CN7.B5(CC2) R47.2
NetLED7_3: LED7.3(BLUE) R41.2
NetLED8_3: LED8.3(BLUE) R42.2
NetLED9_3: LED9.3(BLUE) R50.2
NetR40_2: R40.2 U8.9(~{RST})

Not connected (* = marked no-connect by the designer): CN7 A8(SBU1)* B8(SBU2)*; U8 1(DCD)* 2(RI)* 10(NC1)* 11(~{SUSPEND})* 12(SUSPEND)* 13(NC2)* 14(NC3)* 15(NC4)* 16(NC5)* 17(NC6)* 18(NC7)* 19(NC8)* 20(NC9)* 21(NC10)* 22(NC11)* 23(CTS)* 24(RTS)* 27(DSR)* 28(DTR)*

### Notes on the sheet
- #6  Communication (USB-UART)
- USB Connector (Type-C)
- USB - UART Bridge
- Bypass Capacitors
- (near C44) BC For LED
- Indication LED (VBUS)
- BC For CP2102
- Title
- Rev
- Doc
- Sheet #
- of
- Author
- This document is copyright of ArkX and shall not be revealed, produced, copied, in whole or in part,
- Date
- ©2024
- nor used for any purpose other than submitted.

### Library data of the parts
C41 C45 = CAP_1uF/50V/1608: Ceramic CAP_1uF/50V/1608; LCSC Part #: C15849; JLCPCB Part Type: Basic Part
C42 C43 = CAP_NC_15pF/16V/1608: Ceramic CAP_15pF/16V/1608
C44 = CAP_2.2uF/16V/1608: Ceramic CAP_2.2uF/16V/1608; LCSC Part #: C23630; JLCPCB Part Type: Basic Part
C46 = CAP_100nF/50V/1608: Ceramic CAP_100nF/50V/1608; LCSC Part #: C14663; JLCPCB Part Type: Basic Part
C47 = CAP_100nF/16V/1005: Ceramic CAP_100nF/16V/1005; LCSC Part #: C1525; JLCPCB Part Type: Basic Part
CN7 = CON_USB-Type-C: USB 2.0 5A 1 Surface Mount 16 Female -35℃~+75℃ Type-C SMD  USB Connectors ROHS; LCSC Part #: C2977718; JLCPCB Part Type: Extended Part
LED7-LED9 = LED_MHT170RGBCT(BLUE): Colorless transparence -30℃~+85℃ Positive post Common anode RGB 120° 0805  Light Emitting Diodes (LED) ROHS; LCSC Part #: C2962094; JLCPCB Part Type: Extended Part
R40 = RES_4.7K/1608/0.1W: as R16 on sheet 03_MCU; Size: 1608; LCSC Part #: C23162; JLCPCB Part Type: Basic Part
R41 R42 = RES_330R/1608/0.1W: Value: 330R; Power Rating: 0.1W; Precision: 1%; Size: 1608; LCSC Part #: C23138; JLCPCB Part Type: Basic Part
R43-R46 = RES_0R/1608/0.1W: as R10 on sheet 03_MCU; Size: 1608; LCSC Part #: C21189; JLCPCB Part Type: Basic Part
R47 R48 = RES_5.1K/1608/0.1W: Value: 5.1K; Power Rating: 0.1W; Precision: 1%; Size: 1608; LCSC Part #: C23186; JLCPCB Part Type: Basic Part
R49 = RES_1M/1608/0.1W: Value: 1M; Power Rating: 0.1W; Precision: 1%; Size: 1608; LCSC Part #: C22935; JLCPCB Part Type: Basic Part
R50 = RES_680R/2012/0.125W: Value: 680R; Power Rating: 0.125W; Precision: 1%; Size: 2012; LCSC Part #: C17798; JLCPCB Part Type: Basic Part
U8 = IC_USB_CP2102: Transceiver 1Mbps USB 1/1 QFN-28_5x5x05P  USB ICs ROHS; LCSC Part #: C6568; JLCPCB Part Type: Basic Part

## Nets that join several sheets
DGND: 03_MCU (35 pins), 04_LCD (18 pins), 05_Sensor_Keypad (11 pins), 06_Communication (15 pins)
DP3.3VS: 03_MCU (34 pins), 04_LCD (10 pins), 05_Sensor_Keypad (17 pins), 06_Communication (8 pins)
DP5VS: 03_MCU (CN8.1), 04_LCD (11 pins)
MCU_ADC3_INN1: 03_MCU (U3.17), 05_Sensor_Keypad (SB5.2)
MCU_ADC3_INP1: 03_MCU (U3.18), 05_Sensor_Keypad (SB4.2)
MCU_ADC_I2C1_SCL: 03_MCU (U3.92), 05_Sensor_Keypad (R31.1 U6.3)
MCU_ADC_I2C1_SDA: 03_MCU (U3.93), 05_Sensor_Keypad (R32.1 U6.4)
MCU_BUZZER_EN: 03_MCU (U3.29), 04_LCD (R27.2)
MCU_CHAR_LCD_DATA0: 03_MCU (U3.81), 04_LCD (LCD1.7)
MCU_CHAR_LCD_DATA1: 03_MCU (U3.82), 04_LCD (LCD1.8)
MCU_CHAR_LCD_DATA2: 03_MCU (U3.83), 04_LCD (LCD1.9)
MCU_CHAR_LCD_DATA3: 03_MCU (U3.84), 04_LCD (LCD1.10)
MCU_CHAR_LCD_DATA4: 03_MCU (U3.85), 04_LCD (LCD1.11)
MCU_CHAR_LCD_DATA5: 03_MCU (U3.86), 04_LCD (LCD1.12)
MCU_CHAR_LCD_DATA6: 03_MCU (U3.87), 04_LCD (LCD1.13)
MCU_CHAR_LCD_DATA7: 03_MCU (U3.88), 04_LCD (LCD1.14)
MCU_CHAR_LCD_E: 03_MCU (U3.57), 04_LCD (LCD1.6)
MCU_CHAR_LCD_RS: 03_MCU (U3.55), 04_LCD (LCD1.4)
MCU_CHAR_LCD_RW: 03_MCU (U3.56), 04_LCD (LCD1.5)
MCU_DAC1_OUT: 03_MCU (U3.28), 05_Sensor_Keypad (SB2.1)
MCU_DAC_I2C2_SCL: 03_MCU (U3.46), 05_Sensor_Keypad (R29.1 U5.5)
MCU_DAC_I2C2_SDA: 03_MCU (U3.47), 05_Sensor_Keypad (R30.1 U5.4)
MCU_ETC_I2C4_SCL: 03_MCU (R16.1 U3.59 U4.6), 05_Sensor_Keypad (R38.1 U7.2)
MCU_ETC_I2C4_SDA: 03_MCU (R17.1 U3.60 U4.5), 05_Sensor_Keypad (R39.1 U7.1)
MCU_IR_SEN_DATA_IN: 03_MCU (U3.35), 04_LCD (SEN1.1)
MCU_KEYPAD_COL1: 03_MCU (U3.78), 05_Sensor_Keypad (KEYPAD1.3 R33.2)
MCU_KEYPAD_COL2: 03_MCU (U3.79), 05_Sensor_Keypad (KEYPAD1.1 R34.2)
MCU_KEYPAD_COL3: 03_MCU (U3.80), 05_Sensor_Keypad (KEYPAD1.5 R35.2)
MCU_KEYPAD_ROW1: 03_MCU (U3.63), 05_Sensor_Keypad (KEYPAD1.2)
MCU_KEYPAD_ROW2: 03_MCU (U3.64), 05_Sensor_Keypad (KEYPAD1.7)
MCU_KEYPAD_ROW3: 03_MCU (U3.65), 05_Sensor_Keypad (KEYPAD1.6)
MCU_KEYPAD_ROW4: 03_MCU (U3.66), 05_Sensor_Keypad (KEYPAD1.4)
MCU_TEMP-SEN_OS: 03_MCU (U3.62), 05_Sensor_Keypad (R37.1 U7.3)
MCU_TFT_LCD_DATA0: 03_MCU (U3.97), 04_LCD (TFT1.10)
MCU_TFT_LCD_DATA1: 03_MCU (U3.98), 04_LCD (TFT1.11)
MCU_TFT_LCD_DATA2: 03_MCU (U3.1), 04_LCD (TFT1.12)
MCU_TFT_LCD_DATA3: 03_MCU (U3.2), 04_LCD (TFT1.13)
MCU_TFT_LCD_DATA4: 03_MCU (U3.3), 04_LCD (TFT1.14)
MCU_TFT_LCD_DATA5: 03_MCU (U3.4), 04_LCD (TFT1.15)
MCU_TFT_LCD_DATA6: 03_MCU (U3.5), 04_LCD (TFT1.16)
MCU_TFT_LCD_DATA7: 03_MCU (U3.37), 04_LCD (TFT1.17)
MCU_TFT_LCD_DATA8: 03_MCU (U3.38), 04_LCD (TFT1.18)
MCU_TFT_LCD_DATA9: 03_MCU (U3.39), 04_LCD (TFT1.19)
MCU_TFT_LCD_DATA10: 03_MCU (U3.40), 04_LCD (TFT1.20)
MCU_TFT_LCD_DATA11: 03_MCU (U3.41), 04_LCD (TFT1.21)
MCU_TFT_LCD_DATA12: 03_MCU (U3.42), 04_LCD (TFT1.22)
MCU_TFT_LCD_DATA13: 03_MCU (U3.43), 04_LCD (TFT1.23)
MCU_TFT_LCD_DATA14: 03_MCU (U3.44), 04_LCD (TFT1.24)
MCU_TFT_LCD_DATA15: 03_MCU (U3.45), 04_LCD (TFT1.25)
MCU_TFT_LCD_nCS: 03_MCU (U3.31), 04_LCD (TFT1.5)
MCU_TFT_LCD_nRST: 03_MCU (U3.30), 04_LCD (TFT1.4)
MCU_TFT_LCD_nWR: 03_MCU (U3.69), 04_LCD (TFT1.7)
MCU_TFT_LCD_RS: 03_MCU (U3.68), 04_LCD (TFT1.6)
MCU_TFT_LCD_TS_nCS: 03_MCU (U3.70), 04_LCD (TFT1.34)
MCU_TFT_LCD_TS_nINT: 03_MCU (U3.67), 04_LCD (TFT1.38)
MCU_TFT_LCD_TS_SPI2_MISO: 03_MCU (U3.53), 04_LCD (TFT1.36)
MCU_TFT_LCD_TS_SPI2_MOSI: 03_MCU (U3.54), 04_LCD (TFT1.35)
MCU_TFT_LCD_TS_SPI2_SCK: 03_MCU (U3.52), 04_LCD (TFT1.37)
MCU_UART2_RX: 03_MCU (U3.25), 06_Communication (R41.1 R45.2)
MCU_UART2_TX: 03_MCU (U3.24), 06_Communication (R42.1 R46.2)